# EAGLE design NucleoShield (EAGLE 7.4.0)
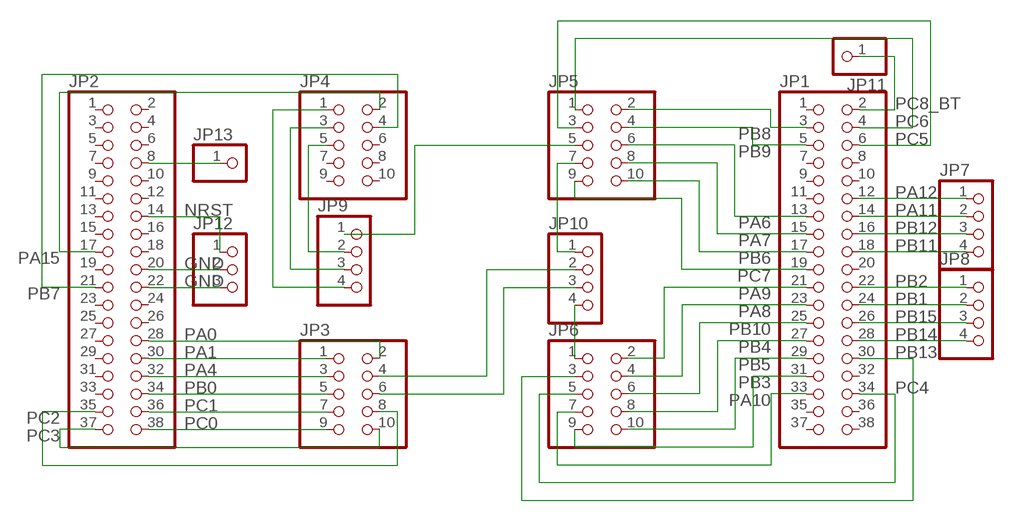
[diagram p0: schematic, sheet 1]

## Parts
JP1  PINHD-2X19  [2X19]
JP2  PINHD-2X19  [2X19]
JP3  PINHD-2X5  [2X05]
JP4  PINHD-2X5  [2X05]
JP5  PINHD-2X5  [2X05]
JP6  PINHD-2X5  [2X05]
JP7  PINHD-1X4  [1X04]
JP8  PINHD-1X4  [1X04]
JP9  PINHD-1X4  [1X04]
JP10  PINHD-1X4  [1X04]
JP11  PINHD-1X1  [1X01]
JP12  PINHD-1X3  [1X03]
JP13  PINHD-1X1  [1X01]

## Nets
GND: JP2.20 JP2.22 JP12.2 JP12.3
N$1: JP3.6 JP10.3
N$2: JP3.4 JP10.2
N$3: JP6.1 JP10.4
N$4: JP5.7 JP10.1
N$5: JP5.5 JP9.1
N$6: JP4.5 JP9.2
N$7: JP4.3 JP9.3
N$8: JP4.1 JP9.4
N$9: JP2.8 JP13.1
NRST: JP2.14 JP12.1
PA0: JP2.28 JP3.2
PA1: JP2.30 JP3.1
PA4: JP2.32 JP3.3
PA6: JP1.13 JP5.6
PA7: JP1.15 JP5.8
PA8: JP1.23 JP6.4
PA9: JP1.21 JP6.2
PA10: JP1.33 JP6.7
PA11: JP1.14 JP7.2
PA12: JP1.12 JP7.1
PA15: JP2.17 JP4.2
PB0: JP2.34 JP3.5
PB1: JP1.24 JP8.2
PB2: JP1.22 JP8.1
PB3: JP1.31 JP6.9
PB4: JP1.27 JP6.8
PB5: JP1.29 JP6.10
PB6: JP1.17 JP5.10
PB7: JP2.21 JP4.4
PB8: JP1.3 JP5.2
PB9: JP1.5 JP5.4
PB10: JP1.25 JP6.6
PB11: JP1.18 JP7.4
PB12: JP1.16 JP7.3
PB13: JP1.30 JP6.3
PB14: JP1.28 JP8.4
PB15: JP1.26 JP8.3
PC0: JP2.38 JP3.9
PC1: JP2.36 JP3.7
PC2: JP2.35 JP3.8
PC3: JP2.37 JP3.10
PC4: JP1.34 JP6.5
PC5: JP1.6 JP5.3
PC6: JP1.4 JP5.1
PC7: JP1.19 JP5.9
PC8_BT: JP1.2 JP11.1
Unconnected: JP1.1 JP1.7 JP1.8 JP1.9 JP1.10 JP1.11 JP1.20 JP1.32 JP1.35 JP1.36 JP1.37 JP1.38 JP2.1 JP2.2 JP2.3 JP2.4 JP2.5 JP2.6 JP2.7 JP2.9 JP2.10 JP2.11 JP2.12 JP2.13 JP2.15 JP2.16 JP2.18 JP2.19 JP2.23 JP2.24 JP2.25 JP2.26 JP2.27 JP2.29 JP2.31 JP2.33 JP4.6 JP4.7 JP4.8 JP4.9 JP4.10

## Library data of the parts
JP1 JP2 = pinhead:PINHD-2X19: PIN HEADER
JP3-JP6 = pinhead:PINHD-2X5: PIN HEADER
JP7-JP10 = pinhead:PINHD-1X4: PIN HEADER
JP11 JP13 = pinhead:PINHD-1X1: PIN HEADER
JP12 = pinhead:PINHD-1X3: PIN HEADER

## Board
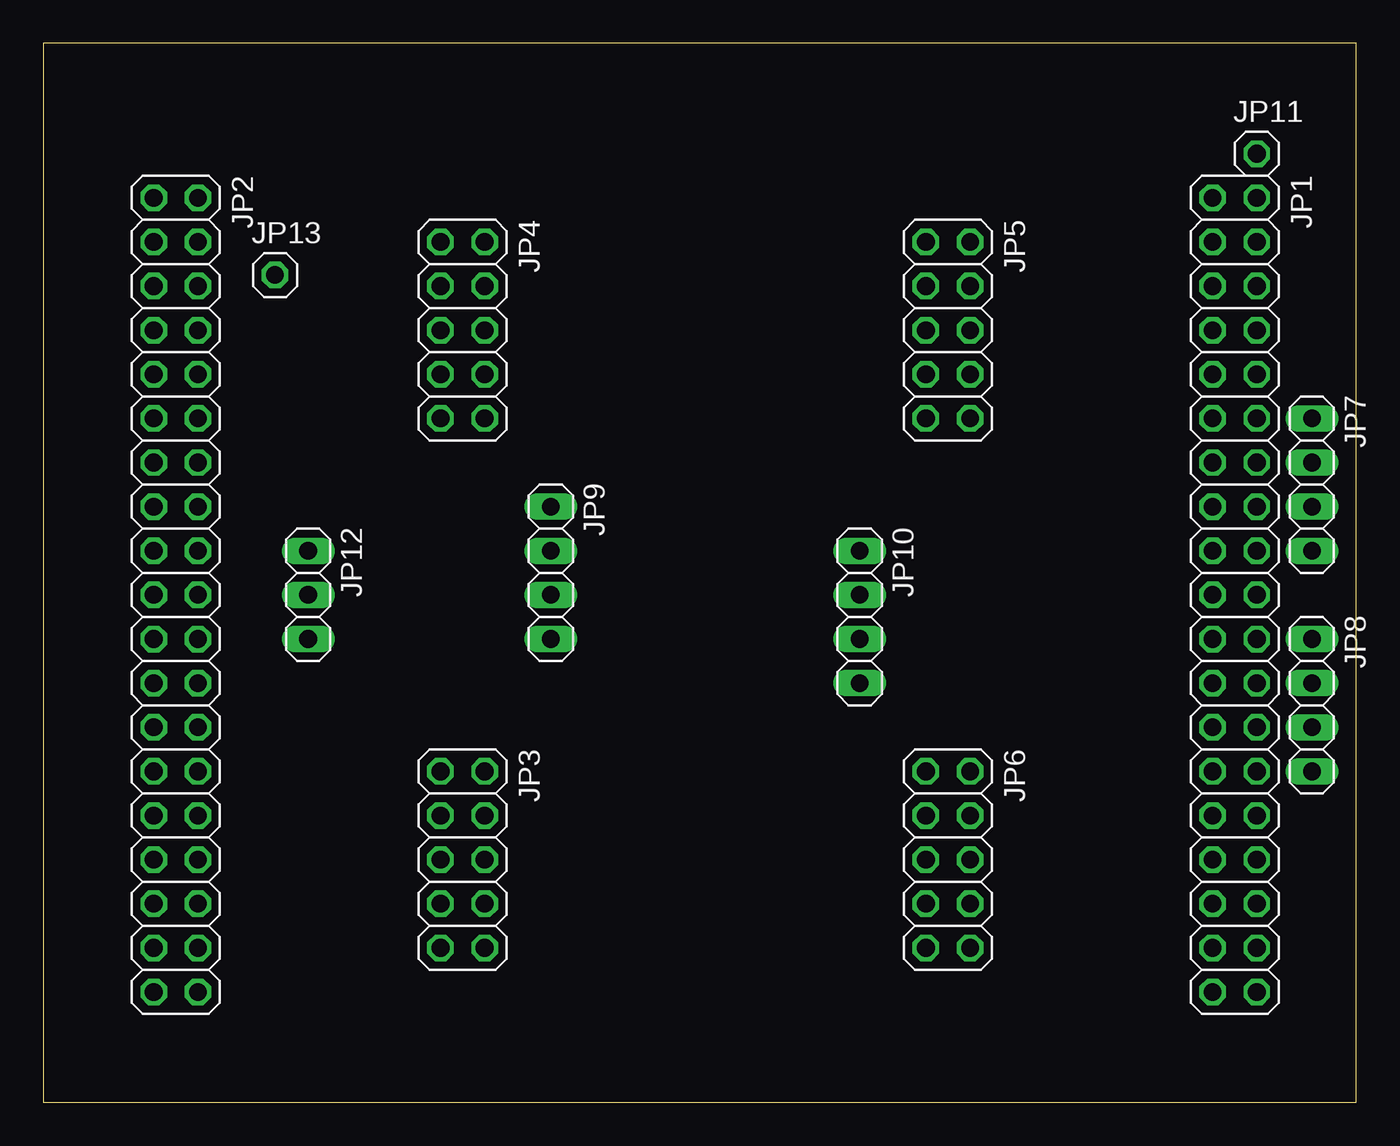
[diagram p1: board, top side]
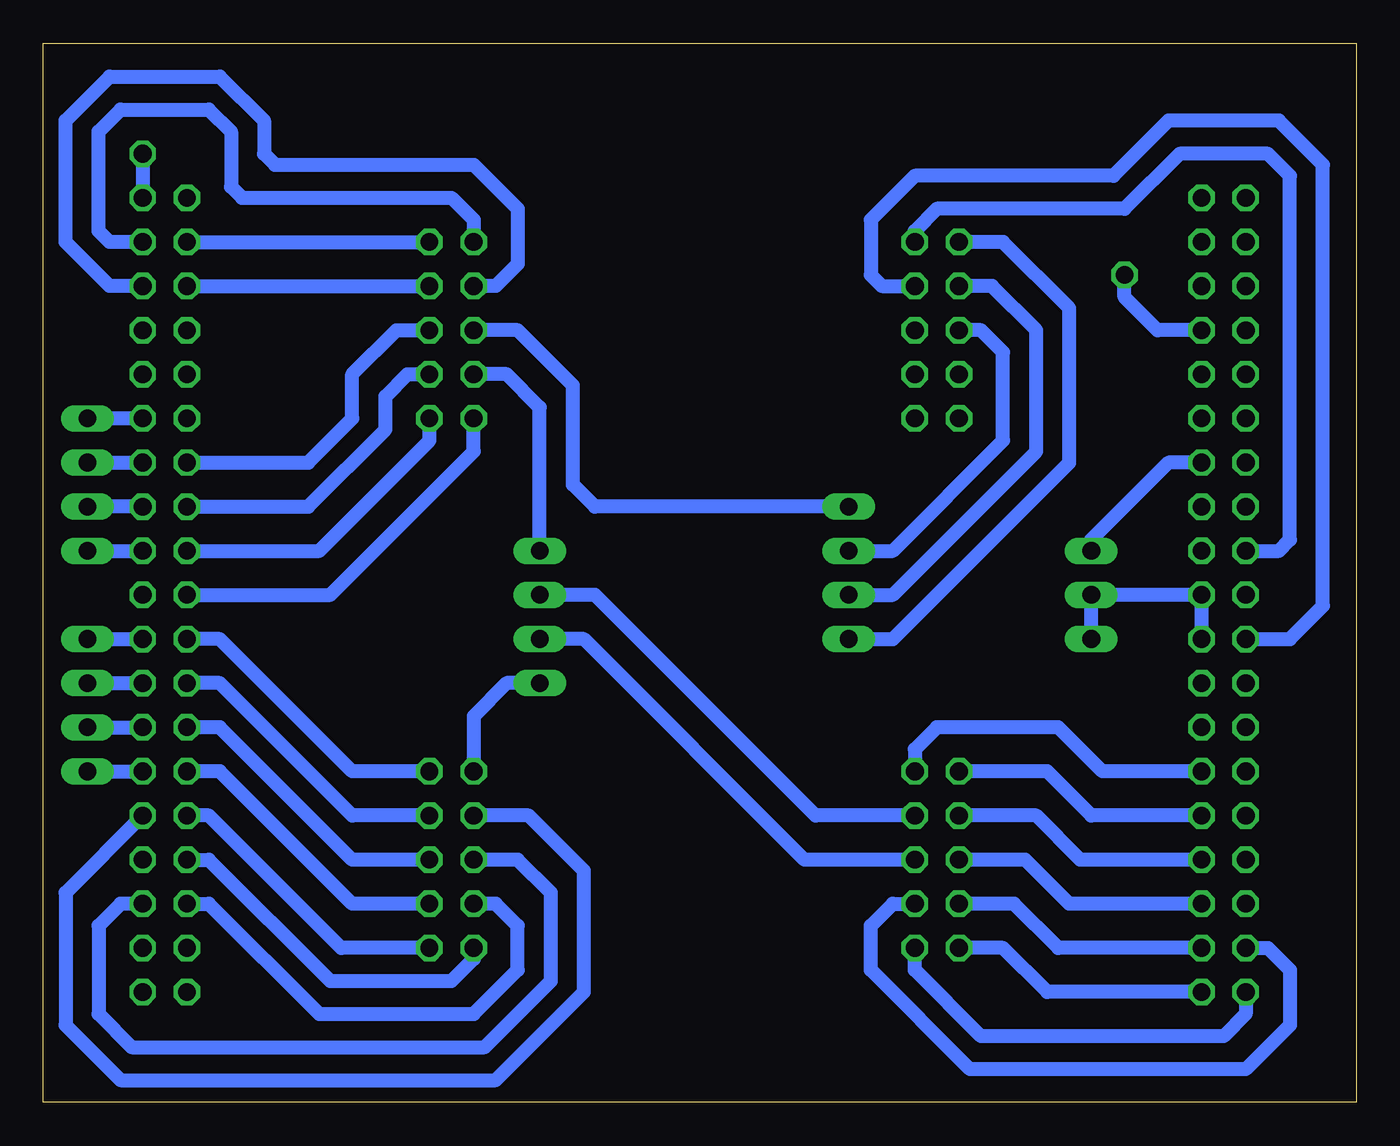
[diagram p2: board, bottom side, seen from below]

Size 75.56 x 60.96 mm. Coordinates in mm from the lower left corner, seen from the top.
Outline: 75.56,60.96 0,60.96 0,0 75.56,0 75.56,60.96
Copper layers (1*16): Top 0.035mm / dielectric 1.5mm / Bottom 0.035mm
Design rules "default": minimum track width 10mil, minimum drill 24mil, track to track 8mil, track to pad 8mil, pad to pad 8mil, via to via 8mil, smd to smd 8mil, copper to edge 40mil, drill to drill 8mil, minimum pad ring 10mil, minimum via ring 8mil, stop-mask expansion 4mil, vias tented up to drill 0mil, thermal gap 10mil

### Footprints (pad centres in the part's own frame; a part is rotated, then mirrored left to right if it is on the bottom)
2X19 = drill 1.016 octagon: 1 -22.86,-1.27; 2 -22.86,1.27; 3 -20.32,-1.27; 4 -20.32,1.27; 5 -17.78,-1.27; 6 -17.78,1.27; 7 -15.24,-1.27; 8 -15.24,1.27; 9 -12.7,-1.27; 10 -12.7,1.27; 11 -10.16,-1.27; 12 -10.16,1.27; 13 -7.62,-1.27; 14 -7.62,1.27; 15 -5.08,-1.27; 16 -5.08,1.27; 17 -2.54,-1.27; 18 -2.54,1.27; 19 0,-1.27; 20 0,1.27; 21 2.54,-1.27; 22 2.54,1.27; 23 5.08,-1.27; 24 5.08,1.27; 25 7.62,-1.27; 26 7.62,1.27; 27 10.16,-1.27; 28 10.16,1.27; 29 12.7,-1.27; 30 12.7,1.27; 31 15.24,-1.27; 32 15.24,1.27; 33 17.78,-1.27; 34 17.78,1.27; 35 20.32,-1.27; 36 20.32,1.27; 37 22.86,-1.27; 38 22.86,1.27
2X05 = drill 1.016 octagon: 1 -5.08,-1.27; 2 -5.08,1.27; 3 -2.54,-1.27; 4 -2.54,1.27; 5 0,-1.27; 6 0,1.27; 7 2.54,-1.27; 8 2.54,1.27; 9 5.08,-1.27; 10 5.08,1.27
1X04 = drill 1.016 long: 1 -3.81,0; 2 -1.27,0; 3 1.27,0; 4 3.81,0
1X01 = drill 1.016 octagon: 1 0,0
1X03 = drill 1.016 long: 1 -2.54,0; 2 0,0; 3 2.54,0

### Placement (x,y rotation side)
JP1  68.58,29.21 270 top
JP2  7.62,29.21 270 top
JP3  24.13,13.97 270 top
JP4  24.13,44.45 270 top
JP5  52.07,44.45 270 top
JP6  52.07,13.97 270 top
JP7  73.03,35.56 270 top
JP8  73.03,22.86 270 top
JP9  29.21,30.48 270 top
JP10  46.99,27.94 270 top
JP11  69.85,54.61 0 top
JP12  15.24,29.21 270 top
JP13  13.33,47.62 0 top

### Tracks (layer width: path | path; a pad name or v marks a point on that pad's centre or on a via)
GND
  Bottom 0.813: JP2.22 JP2.20 JP12.2 JP12.3
N$1
  Bottom 0.813: JP3.6 31.75,13.97 44.45,26.67 JP10.3
N$2
  Bottom 0.813: JP3.4 31.11,16.51 43.81,29.21 JP10.2
N$3
  Bottom 0.813: JP10.4 48.89,24.13 50.8,22.22 JP6.1
N$4
  Bottom 0.813: JP10.1 46.99,40 48.89,41.91 JP5.7
N$5
  Bottom 0.813: JP5.5 48.26,44.45 45.08,41.28 45.08,35.56 43.81,34.29 JP9.1
N$6
  Bottom 0.813: JP9.2 26.67,31.75 20.32,38.1 20.32,43.18 21.59,44.45 JP4.5
N$7
  Bottom 0.813: JP9.3 26.67,29.21 18.41,37.47 18.41,44.45 20.95,46.99 JP4.3
N$8
  Bottom 0.813: JP9.4 26.67,26.67 16.51,36.83 16.51,45.72 20.32,49.53 JP4.1
N$9
  Bottom 0.813: JP2.8 11.43,44.45 13.33,46.35 JP13.1
NRST
  Bottom 0.813: JP2.14 10.79,36.83 15.24,32.39 JP12.1
PA0
  Bottom 0.813: JP2.28 14.6,19.05 17.14,21.59 24.13,21.59 25.4,20.32 JP3.2
PA1
  Bottom 0.813: JP2.30 15.24,16.51 17.78,19.05 JP3.1
PA4
  Bottom 0.813: JP2.32 15.88,13.97 18.41,16.51 JP3.3
PA6
  Bottom 0.813: JP1.13 60.32,36.83 57.78,39.37 57.78,41.91 55.25,44.45 JP5.6
PA7
  Bottom 0.813: JP1.15 60.32,34.29 55.88,38.73 55.88,40.64 54.61,41.91 JP5.8
PA8
  Bottom 0.813: JP6.4 57.78,16.51 65.41,24.13 JP1.23
PA9
  Bottom 0.813: JP6.2 57.78,19.05 65.41,26.67 JP1.21
PA10
  Bottom 0.813: JP1.33 66.04,11.43 59.69,5.08 50.8,5.08 48.26,7.62 48.26,10.16 49.53,11.43 JP6.7
PA11
  Bottom 0.813: JP7.2 JP1.14
PA12
  Bottom 0.813: JP1.12 JP7.1
PA15
  Bottom 0.813: JP2.17 4.44,31.75 3.81,32.39 3.81,53.34 5.08,54.61 10.16,54.61 13.33,51.44 24.13,51.44 25.4,50.16 JP4.2
PB0
  Bottom 0.813: JP2.34 16.51,11.43 19.05,13.97 JP3.5
PB1
  Bottom 0.813: JP8.2 JP1.24
PB2
  Bottom 0.813: JP8.1 JP1.22
PB3
  Bottom 0.813: JP1.31 66.04,13.97 59.06,6.98 52.07,6.98 50.8,8.25 JP6.9
PB4
  Bottom 0.813: JP6.8 57.78,11.43 65.41,19.05 JP1.27
PB5
  Bottom 0.813: JP6.10 58.42,8.89 66.04,16.51 JP1.29
PB6
  Bottom 0.813: JP1.17 59.69,31.75 53.34,38.1 JP5.10
PB7
  Bottom 0.813: JP2.21 3.81,26.67 1.9,28.57 1.9,53.97 4.44,56.52 10.79,56.52 13.97,53.34 25.4,53.34 27.94,50.8 27.94,47.62 27.3,46.99 JP4.4
PB8
  Bottom 0.813: JP1.3 JP5.2
PB9
  Bottom 0.813: JP1.5 JP5.4
PB10
  Bottom 0.813: JP6.6 57.78,13.97 65.41,21.59 JP1.25
PB11
  Bottom 0.813: JP7.4 JP1.18
PB12
  Bottom 0.813: JP1.16 JP7.3
PB13
  Bottom 0.813: JP1.30 74.29,12.07 74.29,4.45 71.12,1.27 49.53,1.27 44.45,6.35 44.45,13.33 47.62,16.51 JP6.3
PB14
  Bottom 0.813: JP8.4 JP1.28
PB15
  Bottom 0.813: JP8.3 JP1.26
PC0
  Bottom 0.813: JP2.38 17.78,6.35 20.32,8.89 JP3.9
PC1
  Bottom 0.813: JP2.36 17.14,8.89 19.68,11.43 JP3.7
PC2
  Bottom 0.813: JP2.35 5.08,8.89 3.81,7.62 3.81,4.45 6.35,1.91 22.22,1.91 27.94,7.62 27.94,10.16 26.67,11.43 JP3.8
PC3
  Bottom 0.813: JP2.37 6.35,5.08 7.62,3.81 21.59,3.81 25.4,7.62 JP3.10
PC4
  Bottom 0.813: JP1.34 71.12,11.43 72.39,10.16 72.39,5.08 70.48,3.18 50.16,3.18 46.35,6.98 46.35,12.07 48.26,13.97 JP6.5
PC5
  Bottom 0.813: JP1.6 71.75,46.99 74.29,49.53 74.29,56.52 71.75,59.05 65.41,59.05 62.86,56.52 62.86,54.61 62.23,53.97 50.8,53.97 48.26,51.44 48.26,48.26 49.53,46.99 JP5.3
PC6
  Bottom 0.813: JP1.4 71.75,49.53 72.39,50.16 72.39,55.88 71.12,57.15 66.04,57.15 64.77,55.88 64.77,52.7 64.13,52.07 52.07,52.07 50.8,50.8 JP5.1
PC7
  Bottom 0.813: JP1.19 59.06,29.21 50.8,37.47 JP5.9
PC8_BT
  Bottom 0.813: JP11.1 JP1.2